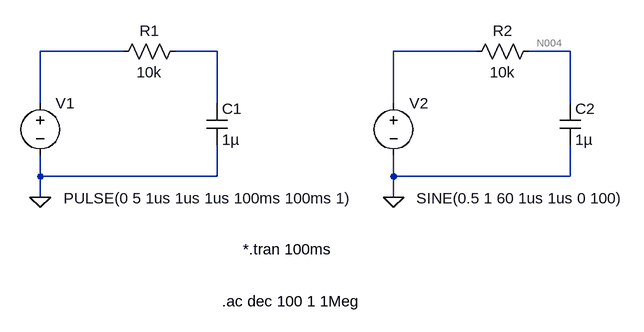
[diagram p0: schematic simple_rc.asc]
simple_rc.asc, the LTspice schematic file:
Version 4
SHEET 1 1244 680
WIRE 288 176 160 176
WIRE 432 176 368 176
WIRE 832 176 704 176
WIRE 976 176 912 176
WIRE 160 256 160 176
WIRE 432 256 432 176
WIRE 704 256 704 176
WIRE 976 256 976 176
WIRE 160 368 160 336
WIRE 432 368 432 320
WIRE 432 368 160 368
WIRE 704 368 704 336
WIRE 976 368 976 320
WIRE 976 368 704 368
WIRE 160 400 160 368
WIRE 704 400 704 368
FLAG 160 400 0
FLAG 704 400 0
SYMBOL Voltage 160 240 R0
WINDOW 3 36 162 Left 2
SYMATTR InstName V1
SYMATTR Value PULSE(0 5 1us 1us 1us 100ms 100ms 1)
SYMBOL Res 384 160 R90
WINDOW 0 0 56 VBottom 2
WINDOW 3 32 56 VTop 2
SYMATTR InstName R1
SYMATTR Value 10k
SYMBOL Cap 416 256 R0
SYMATTR InstName C1
SYMATTR Value 1µ
SYMBOL Voltage 704 240 R0
WINDOW 3 35 162 Left 2
SYMATTR InstName V2
SYMATTR Value SINE(0.5 1 60 1us 1us 0 100)
SYMATTR Value2 AC 1
SYMBOL Res 928 160 R90
WINDOW 0 0 56 VBottom 2
WINDOW 3 32 56 VTop 2
SYMATTR InstName R2
SYMATTR Value 10k
SYMBOL Cap 960 256 R0
SYMATTR InstName C2
SYMATTR Value 1µ
TEXT 472 480 Left 2 !*.tran 100ms
TEXT 440 560 Left 2 !.ac dec 100 1 1Meg

The netlist it stands for:
* simple_rc.asc
V1 N001 0 PULSE(0 5 1us 1us 1us 100ms 100ms 1)
R1 N002 N001 10k
C1 N002 0 1µ
V2 N003 0 SINE(0.5 1 60 1us 1us 0 100) AC 1
R2 N004 N003 10k
C2 N004 0 1µ
*.tran 100ms
.ac dec 100 1 1Meg
.backanno
.end

* Results of the author's LTspice run, read from the files saved beside the schematic
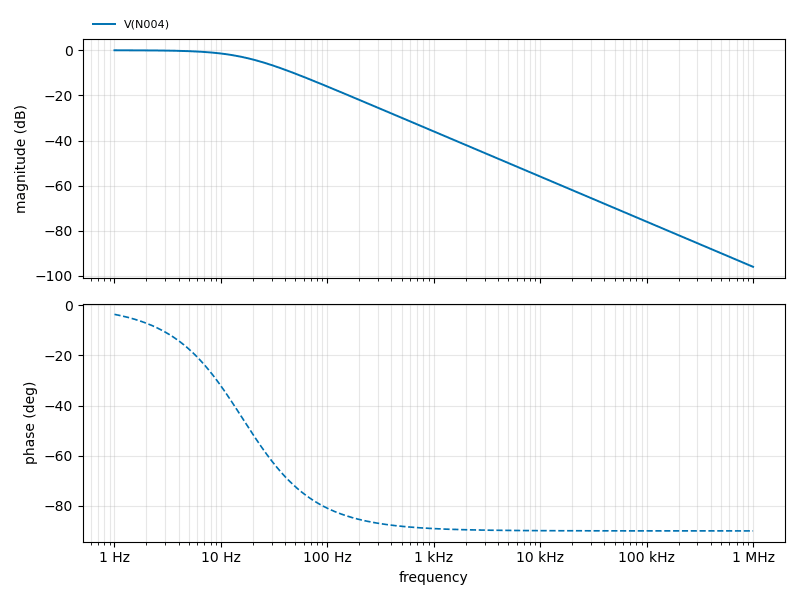
[diagram p1: AC Analysis of simple_rc.asc, plotted from the saved traces]
* AC Analysis, 1 run:
*   V(N004): -0.02 dB at 1 Hz, -95.96 dB at 1 MHz, peak -0.02 dB at 1 Hz, 3 dB below the peak at 15.98 Hz